# Altium project PCB_Connectors.PrjPcb
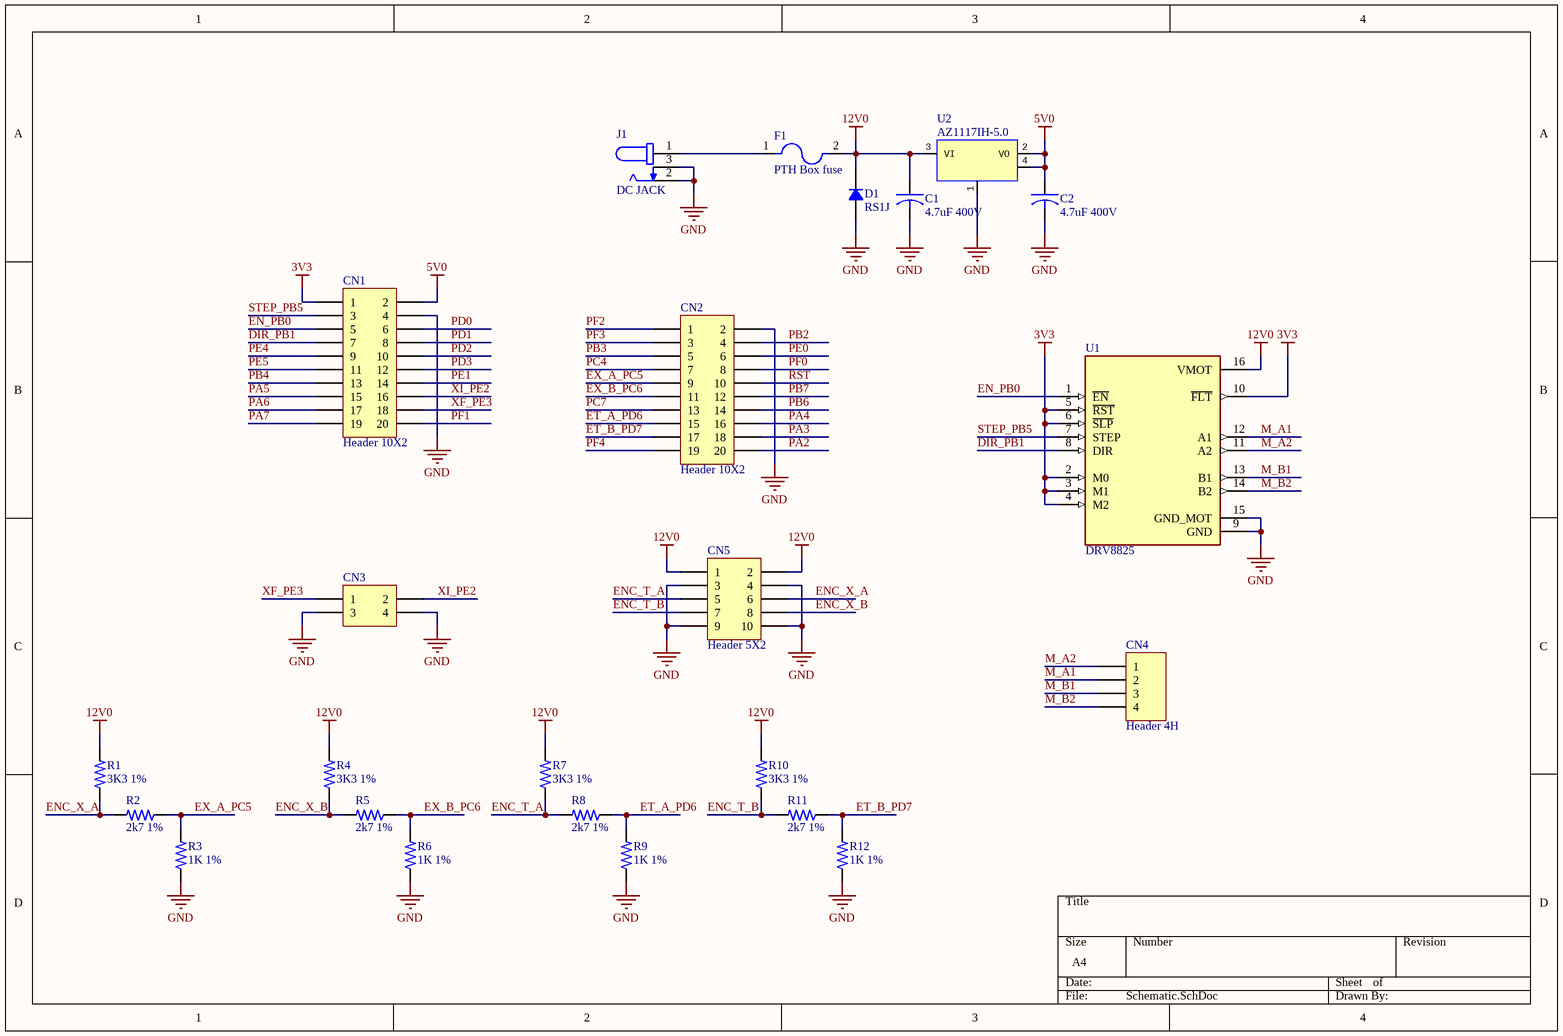
[diagram p0: Schematic.SchDoc]
1 sheet, 24 parts. Net scope: global (net labels, ports and power ports of the same name join across sheets).

## Sheet Schematic.SchDoc
size A4

### Parts
C1  4.7uF 400V  [cap Aluminum 8x13mm Horizontal]
C2  4.7uF 400V  [cap Aluminum 8x13mm Horizontal]
CN1  Header 10X2  [Header 10x2]
CN2  Header 10X2  [Header 10x2]
CN3  Header 2X2 Right Angle  [Header 2x2 Right Angle]  (value not drawn)
CN4  Header 4H  [HDR1X4H]
CN5  Header 5X2  [Header 5x2 Right Angle]
D1  value RS1J  [DO-214AC - ROUNDED]  (hidden comment: Fast Recovery)
F1  PTH Box fuse  [FUSRR508W60L835T400H810]
J1  DC JACK  [DC JACK 2x6.5]
R1  value 3K3 1%  [RES0603 - rounded]  (hidden comment: 3K3 1/16W 1% 0603)
R2  value 2k7 1%  [RES0603 - rounded]  (hidden comment: 2k7 1/10W 1% 0603)
R3  value 1K 1%  [RES0603 - rounded]  (hidden comment: 1K 1/10W 1% 0603)
R4  value 3K3 1%  [RES0603 - rounded]  (hidden comment: 3K3 1/16W 1% 0603)
R5  value 2k7 1%  [RES0603 - rounded]  (hidden comment: 2k7 1/10W 1% 0603)
R6  value 1K 1%  [RES0603 - rounded]  (hidden comment: 1K 1/10W 1% 0603)
R7  value 3K3 1%  [RES0603 - rounded]  (hidden comment: 3K3 1/16W 1% 0603)
R8  value 2k7 1%  [RES0603 - rounded]  (hidden comment: 2k7 1/10W 1% 0603)
R9  value 1K 1%  [RES0603 - rounded]  (hidden comment: 1K 1/10W 1% 0603)
R10  value 3K3 1%  [RES0603 - rounded]  (hidden comment: 3K3 1/16W 1% 0603)
R11  value 2k7 1%  [RES0603 - rounded]  (hidden comment: 2k7 1/10W 1% 0603)
R12  value 1K 1%  [RES0603 - rounded]  (hidden comment: 1K 1/10W 1% 0603)
U1  DRV8825  [IC_DRV8825_STEPPER_MOTOR_DRIVER_CARRIER]
U2  value AZ1117IH-5.0  [SOT-223]  (hidden comment: Linear Voltage Regulator Positive Fixed Output 3.3V 1A SOT223)

### Nets
3V3: CN1.1 U1.2(M0) U1.3(M1) U1.4(M2) U1.5(~{RST}) U1.6(~{SLP}) U1.10(~{FLT})
5V0: C2.1 CN1.2 U2.2(VO) U2.4(VO)
12V0: C1.1 CN5.1 CN5.2 D1.K F1.2 R1.2 R4.2 R7.2 R10.2 U1.16(VMOT) U2.3(VI)
GND: C1.2 C2.2 CN1.4 CN2.2 CN3.3 CN3.4 CN5.3 CN5.4 CN5.9 CN5.10 D1.A J1.2 J1.3 R3.1 R6.1 R9.1 R12.1 U1.9(GND) U1.15(GND_MOT) U2.1(GND)
DIR_PB1: CN1.7 U1.8(DIR)
EN_PB0: CN1.5 U1.1(~{EN})
ENC_T_A: CN5.5 R7.1 R8.2
ENC_T_B: CN5.7 R10.1 R11.2
ENC_X_A: CN5.6 R1.1 R2.2
ENC_X_B: CN5.8 R4.1 R5.2
ET_A_PD6: CN2.15 R8.1 R9.2
ET_B_PD7: CN2.17 R11.1 R12.2
EX_A_PC5: CN2.9 R2.1 R3.2
EX_B_PC6: CN2.11 R5.1 R6.2
M_A1: CN4.2 U1.12(A1)
M_A2: CN4.1 U1.11(A2)
M_B1: CN4.3 U1.13(B1)
M_B2: CN4.4 U1.14(B2)
PA2: CN2.20
PA3: CN2.18
PA4: CN2.16
PA5: CN1.15
PA6: CN1.17
PA7: CN1.19
PB2: CN2.4
PB3: CN2.5
PB4: CN1.13
PB6: CN2.14
PB7: CN2.12
PC4: CN2.7
PC7: CN2.13
PD0: CN1.6
PD1: CN1.8
PD2: CN1.10
PD3: CN1.12
PE0: CN2.6
PE1: CN1.14
PE4: CN1.9
PE5: CN1.11
PF0: CN2.8
PF1: CN1.20
PF2: CN2.1
PF3: CN2.3
PF4: CN2.19
RST: CN2.10
STEP_PB5: CN1.3 U1.7(STEP)
XF_PE3: CN1.18 CN3.1
XI_PE2: CN1.16 CN3.2
NetF1_1: F1.1 J1.1

### Library data of the parts
C1 C2 = 4.7uF 400V PTH ALUM: CAP ALUM 4.7UF 20% 400V RADIAL; Manufacturer: ANY; Cod: 0103000132; Lead Spacing: 3.5mm; Width: 8mm; Mounting Type: PTH; Height: 13mm; Value: 4.7uF 400V
CN1 CN2 = Header 10X2: Header, 10-Pin, Dual row; LatestRevisionDate: 17-Jul-2002; LatestRevisionNote: Re-released for DXP Platform.; Publisher: Altium Limited
CN3 = Header 2X2 Right Angle: Header, 2-Pin, Dual row, Right Angle; LatestRevisionDate: 17-Jul-2002; LatestRevisionNote: Re-released for DXP Platform.; Publisher: Altium Limited
CN4 = Header 4H: Header, 4-Pin, Right Angle; LatestRevisionDate: 17-Jul-2002; LatestRevisionNote: Re-released for DXP Platform.; Publisher: Altium Limited
CN5 = Header 5X2 Right Angle: Header, 5-Pin, Dual row, Right Angle; LatestRevisionDate: 17-Jul-2002; LatestRevisionNote: Re-released for DXP Platform.; Publisher: Altium Limited
D1 = RS1J: DIODE GEN PURP 600V 1A DO214AC; Manufacturer: ON Semiconductor; Cod: 0106000061; Diode Type: Standard; Speed: Fast Recovery =< 500ns, > 200mA (Io); Capacitance @ Vr, F: 10pF @ 4V, 1MHz; Manufacturer Part Number: RS1J; RoHS: RoHS Compliant; Category: Discrete Semiconductor Products; Packaging: Tape & Reel (TR); Part Status: Active; Current - Average Rectified (Io): 1A; Mounting Type: Surface Mount; Package / Case: DO-214AC, SMA; Operating Temperature - Junction: -55°C ~ 150°C; Base Part Number: RS1J; ComponentLink1URL: https://www.onsemi.com/pub/Collateral/RS1M-D.PDF; ComponentLink1Description: Datasheet
F1 = PTH Box fuse: Radial Box fuse
J1 = DC JACK 2x6.5mm: 2.0 x 6.5 mm, 5.0 A, Horizontal, Through Hole, Dc Power Jack Connector; MF: CUI Devices; MP: PJ-002AH; Purchase-URL: https://pricing.snapeda.com/search/part/PJ-002AH/?ref=eda; Check_prices: https://www.snapeda.com/parts/PJ-002AH/CUI+Devices/view-part/?ref=eda; Value: *; Package: None; Price: None; Availability: In Stock; CUI_purchase_URL: https://www.cuidevices.com/product/interconnect/connectors/dc-power-connectors/jacks/pj-002ah?utm_source=snapeda.com&utm_medium=referral&utm_campaign=snapedaBOM; SnapEDA_Link: https://www.snapeda.com/parts/PJ-002AH/CUI+Devices/view-part/?ref=snap
R1 R4 R7 R10 = 3K3 1/16W 1% 0603: RES SMD 3K3 1/16W 1% 0603; Cod: 0102000154; Mounting Type: SMD; Package / Case: 0603; Manufacturer Part Number: *
R2 R5 R8 R11 = 2k7 1/10W 1% 0603: RES SMD 2k7 1/10W 1% 0603; Cod: 0102000178; Mounting Type: SMD; Package / Case: 0603; Manufacturer Part Number: *
R3 R6 R9 R12 = 1K 1/10W 1% 0603: RES SMD 1K 1/10W 1% 0603; Cod: 0102000201; Mounting Type: SMD; Package / Case: 0603; Manufacturer Part Number: *
U1 = DRV8825_STEPPER_MOTOR_DRIVER_CARRIER: Stepper motor controler; IC: DRV8825; 1.5A; Uin mot: 8.2Ã·45V; Availability: Unavailable; MP: DRV8825_STEPPER_MOTOR_DRIVER_CARRIER; Value: *; Price: None; Package: None
U2 = AZ1117IH-3.3TRG1: IC REG LINEAR 3.3V 1A SOT223; Manufacturer: Diodes; Voltage - Output: 3.3; Voltage - Dropout (Typical): 1.3V @ 800mA; Number of Regulators: 1; Voltage - Input: 3.3 V ~ 15 V; Cod: 0105000055; RoHS: RoHS Compliant; Regulator Topology: Positive Fixed; Current - Output: 1A; Current - Limit (Min): -; Operating Temperature: 0°C ~ 125°C; Mounting Type: Surface Mount; Package / Case: TO-223; ComponentLink1URL: https://www.digikey.com/en/products/detail/diodes-incorporated/AZ1117IH-3-3TRG1/5699672; ComponentLink1Description: https://www.digikey.com/en/products/detail/diodes-incorporated/AZ1117IH-3-3TRG1/5699672; Manufacturer Part Number: AZ1117IH-3.3TRG1